# EAGLE design lora_esp32_gps (EAGLE 9.6.2)
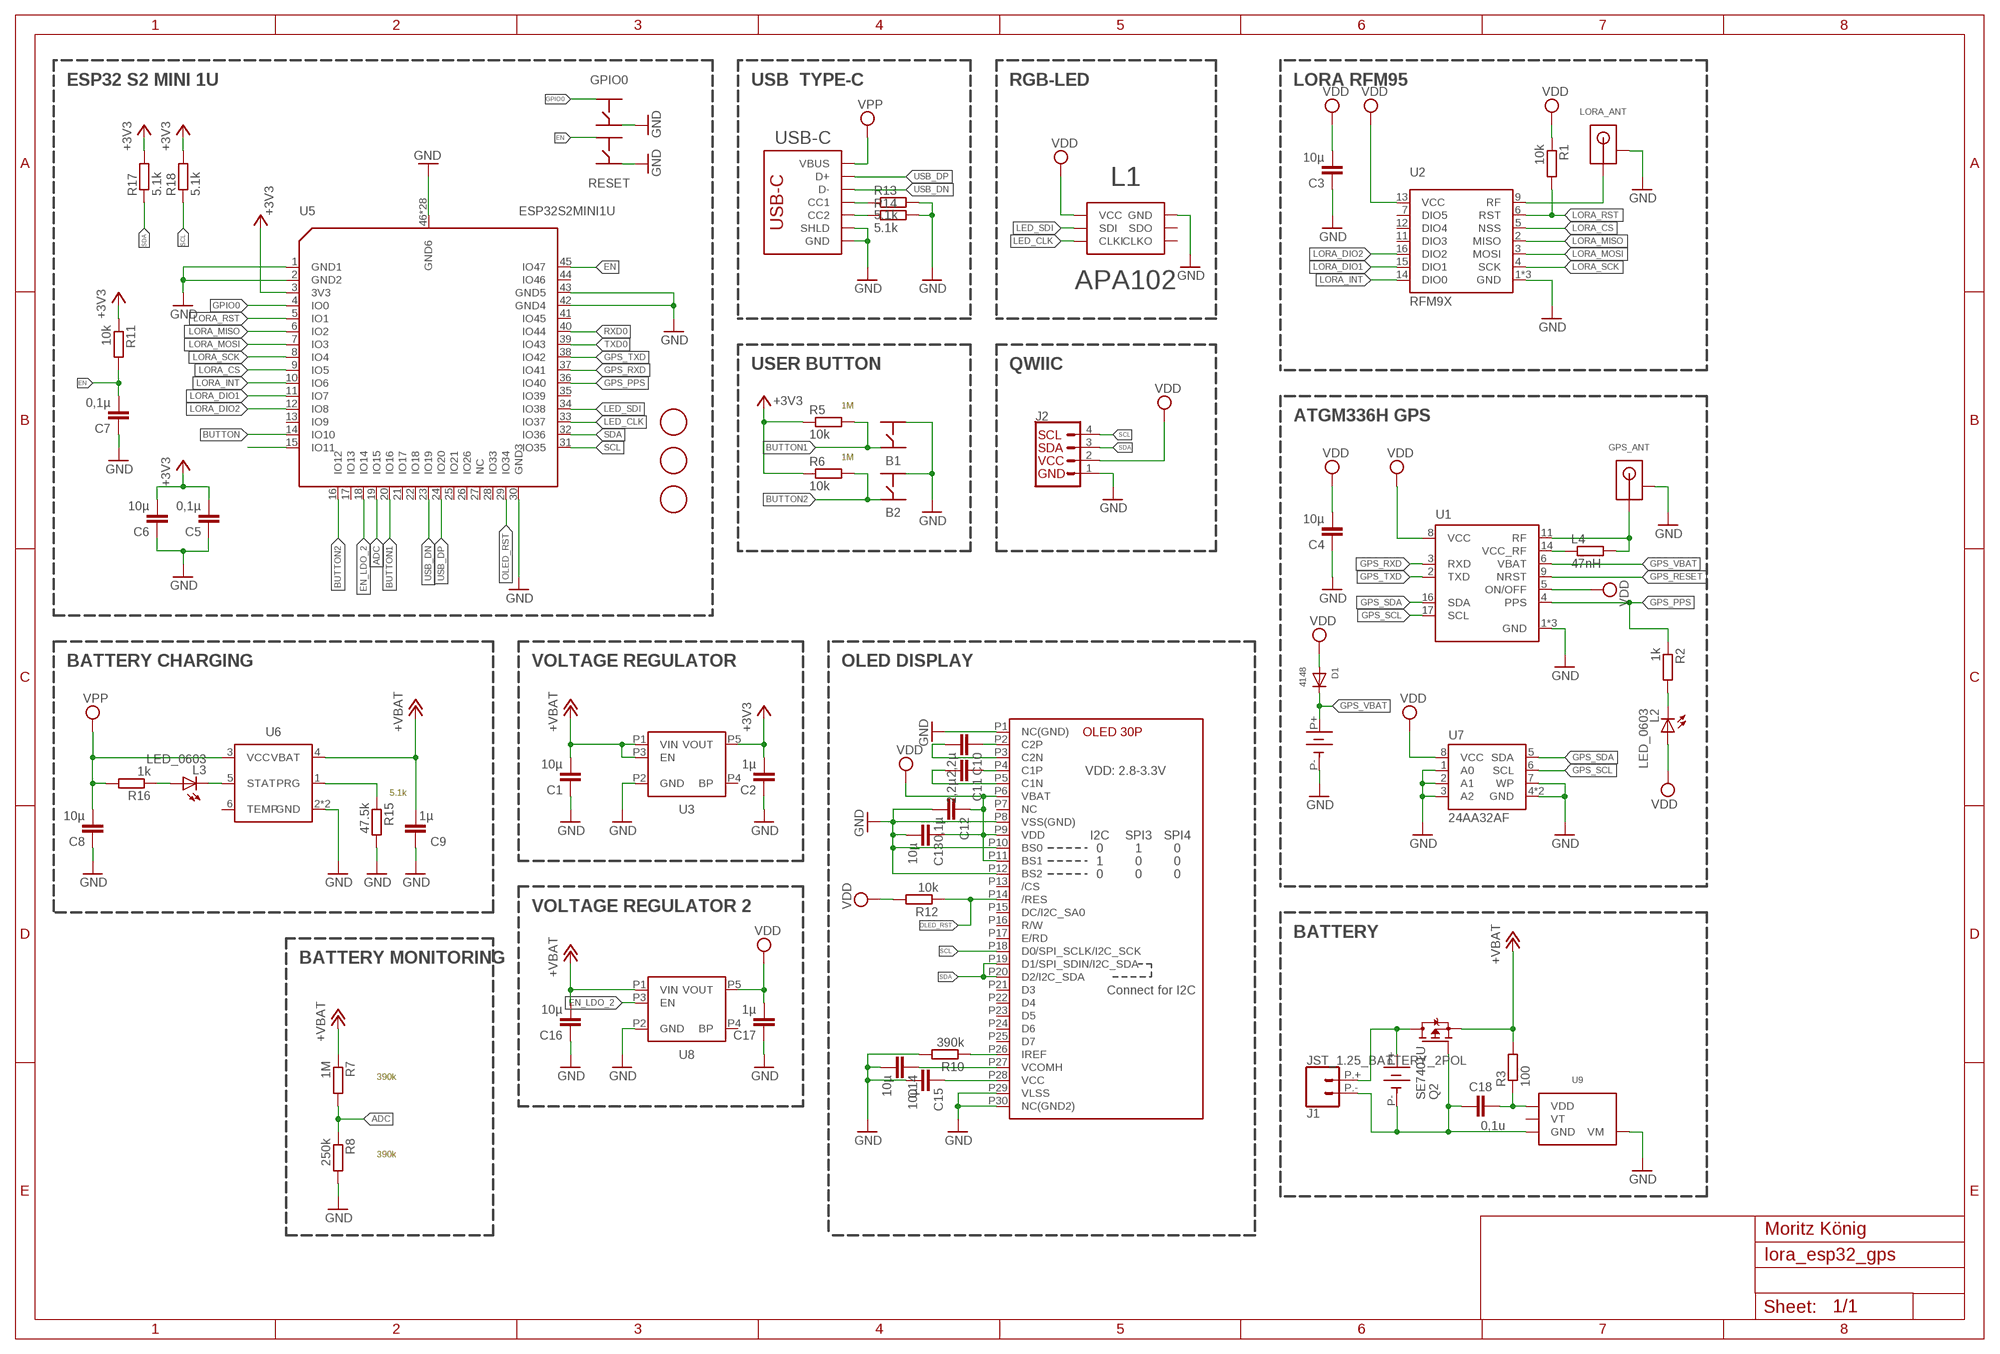
[diagram p0: schematic, sheet 1]

## Parts
B1  PTS840ESDGMSMTRLFS  [PTS840ESDGMSMTRLFS]
B2  PTS840ESDGMSMTRLFS  [PTS840ESDGMSMTRLFS]
BAT2  MS621  [MS621]
C1  10µ  C-EU_WO_KEEPOUT  [C0603]
C2  1µ  C-EU_WO_KEEPOUT  [C0603]
C3  10µ  C0603  [C0603]
C4  10µ  C0603  [C0603]
C5  0,1µ  C-EU_WO_KEEPOUT  [C0603]
C6  10µ  C-EU_WO_KEEPOUT  [C0603]
C7  0,1µ  C0603  [C0603]
C8  10µ  C0603  [C0603]
C9  1µ  C0603  [C0603]
C10  2,2µ  C-EU_WO_KEEPOUT  [C0603]
C11  2,2µ  C-EU_WO_KEEPOUT  [C0603]
C12  0,1µ  C-EU_WO_KEEPOUT  [C0603]
C13  10µ  C-EU_WO_KEEPOUT  [C0603]
C14  10µ  C-EU_WO_KEEPOUT  [C0603]
C15  10µ  C-EU_WO_KEEPOUT  [C0603]
C16  10µ  C-EU_WO_KEEPOUT  [C0603]
C17  1µ  C-EU_WO_KEEPOUT  [C0603]
C18  0,1u  C0603  [C0603]
D1  4148  DIODESOD-323F  [SOD-323F]
FID1  FIDUCIAL  [FIDUCIAL_1MM]
FID2  FIDUCIAL  [FIDUCIAL_1MM]
FID3  FIDUCIAL  [FIDUCIAL_1MM]
GPIO0  BUTTON_4PIN_TS_1177  [TS-1177-C-B-B]
GPS_ANT  UFL_ANT_CONNECTOR  [UFL_ANT_CONNECTOR]
J1  JST_1.25_BATTERY_2POL  [JST_1.25MM_2POL]
J2  QWIIC_CONNECTORJS-1MM  [1X04_1MM_RA]
L1  APA102_2020  [APA102_2020]
L2  LED_0603  [CHIPLED_0603]
L3  LED_0603  [CHIPLED_0603]
L4  47nH  R0402  [R0402]
LORA_ANT  UFL_ANT_CONNECTOR  [UFL_ANT_CONNECTOR]
Q2  SE7401U  [SOT323]
R1  10k  R0603  [R0603]
R2  1k  R0603  [R0603]
R3  100  R0603  [R0603]
R5  10k  R0603  [R0603]
R6  10k  R0603  [R0603]
R7  1M  R0603  [R0603]
R8  250k  R0603  [R0603]
R10  390k  R-EU_WO_KEEPOUT  [R0603]
R11  10k  R0603  [R0603]
R12  10k  R-EU_WO_KEEPOUT  [R0603]
R13  5.1k  R0603  [R0603]
R14  5.1k  R0603  [R0603]
R15  47.5k  R0603  [R0603]
R16  1k  R0603  [R0603]
R17  5.1k  R-EU_WO_KEEPOUT  [R0603]
R18  5.1k  R-EU_WO_KEEPOUT  [R0603]
RESET  BUTTON_4PIN_TS_1177  [TS-1177-C-B-B]
U1  ATGM336H  [ATGM336H-MODULE]
U2  RFM9X  [LORA_RFM9X]
U3  RT9193_SC70-5  [SC-70-5]
U4  OLD_096_SSD1306_30P_2B  [OLED_096_30P_B]
U5  ESP32S2MINI1U  ESP32-S2-MINI-1U  [ESP32-S2-MINI-1U]
U6  WS4518D  [DFN-6]
U7  24AA32AF  [TDFN8]
U8  RT9193_SC70-5  [SC-70-5]
U9  XB5353A  [SOT23-5]
U$2  BATTERY_KEYSTONE_1051  [KEYSTONE_1051]
USB-C  USB_C_C393939  [USBC_C393939]

## Nets
+3V3: C2.2 C5.2 C6.2 R5.1 R6.1 R11.1 R17.2 R18.2 U3.P5(VOUT) U5.3(3V3)
+VBAT: C1.2 C9.2 C16.2 Q2.2(S) R3.2 R7.1 U3.P1(VIN) U3.P3(EN) U6.4(VBAT) U8.P1(VIN)
ADC: R7.2 R8.1 U5.19(IO15)
BUTTON: U5.14(IO10)
BUTTON1: B1.2 R5.2 U5.20(IO16)
BUTTON2: B2.2 R6.2 U5.16(IO12)
EN: C7.2 R11.2 RESET.P4 U5.45(IO47)
EN_LDO_2: U5.18(IO14) U8.P3(EN)
GND: B1.3 B2.3 BAT2.P-(GND) C1.1 C2.1 C3.1 C4.1 C5.1 C6.1 C7.1 C8.1 C9.1 C12.2 C13.2 C14.2 C15.2 C16.1 C17.1 GPIO0.P1 GPS_ANT.P1.-(GND) GPS_ANT.P2.-(GND) J2.1(GND) L1.P6(GND) L1.P6.1(GND) LORA_ANT.P1.-(GND) LORA_ANT.P2.-(GND) R8.2 R10.2 R13.2 R14.2 R15.2 RESET.P1 U1.1(GND) U1.10(GND) U1.12(GND) U2.1(GND) U2.8(GND) U2.10(GND) U3.P2(GND) U4.P1(NC(GND)) U4.P8(VSS(GND)) U4.P10(BS0) U4.P12(BS2) U4.P29(VLSS) U4.P30(NC(GND2)) U5.1(GND1) U5.2(GND2) U5.30(GND3) U5.42(GND4) U5.43(GND5) U5.46(GND6) U5.47(GND6) U5.48(GND6) U5.49(GND6) U5.50(GND6) U5.51(GND6) U5.52(GND6) U5.53(GND6) U5.54(GND6) U5.55(GND6) U5.56(GND6) U5.57(GND6) U5.58(GND6) U5.59(GND6) U5.60(GND6) U5.61(GND6) U5.62(GND6) U5.63(GND6) U5.64(GND6) U5.65(GND6) U5.66(GND6) U5.67(GND6) U5.68(GND6) U5.69(GND6) U5.70(GND6) U5.71(GND6) U5.72(GND6) U5.73(GND6) U6.2(GND) U6.EXP(GND) U7.1(A0) U7.2(A1) U7.3(A2) U7.4(GND) U7.7(WP) U7.EXP(GND) U8.P2(GND) U9.4(VM) U9.5(VM) USB-C.A1B12(GND) USB-C.B1A12(GND) USB-C.S1(SHLD) USB-C.S2(SHLD) USB-C.S3(SHLD) USB-C.S4(SHLD)
GPIO0: GPIO0.P4 U5.4(IO0)
GPS_PPS: R2.1 U1.4(PPS) U5.36(IO40)
GPS_RESET: U1.9(NRST)
GPS_RXD: U1.3(RXD) U5.37(IO41)
GPS_SCL: U1.17(SCL) U7.6(SCL)
GPS_SDA: U1.16(SDA) U7.5(SDA)
GPS_TXD: U1.2(TXD) U5.38(IO42)
GPS_VBAT: BAT2.P+(VCC) D1.C U1.6(VBAT)
LED_CLK: L1.P5(CLKI) U5.33(IO37)
LED_SDI: L1.P4(SDI) U5.34(IO38)
LORA_CS: U2.5(NSS) U5.9(IO5)
LORA_DIO1: U2.15(DIO1) U5.11(IO7)
LORA_DIO2: U2.16(DIO2) U5.12(IO8)
LORA_INT: U2.14(DIO0) U5.10(IO6)
LORA_MISO: U2.2(MISO) U5.6(IO2)
LORA_MOSI: U2.3(MOSI) U5.7(IO3)
LORA_RST: R1.2 U2.6(RST) U5.5(IO1)
LORA_SCK: U2.4(SCK) U5.8(IO4)
N$1: L4.1 U1.14(VCC_RF)
N$2: L2.P$1(C) R2.2
N$3: U5.15(IO11)
N$4: GPS_ANT.ANT L4.2 U1.11(RF)
N$5: LORA_ANT.ANT U2.9(RF)
N$6: C18.2 R3.1 U9.3(VDD)
N$7: C18.1 J1.P.- Q2.1(G) U9.2(GND) U$2.P-(GND)
N$8: R15.1 U6.1(PRG)
N$9: J1.P.+ Q2.3(D) U$2.P+(VCC)
N$13: R14.1 USB-C.B5(CC2)
N$17: C10.1 U4.P2(C2P)
N$19: C10.2 U4.P3(C2N)
N$20: C11.2 U4.P5(C1N)
N$21: R10.1 U4.P26(IREF)
N$24: R13.1 USB-C.A5(CC1)
N$31: C11.1 U4.P4(C1P)
N$32: C15.1 U4.P28(VCC)
N$33: C14.1 U4.P27(VCOMH)
N$34: L3.P$2(A) R16.1
N$35: L3.P$1(C) U6.5(STAT)
OLED_RST: R12.1 U4.P14(/RES) U5.29(IO34)
RXD0: U5.40(IO44)
SCL: J2.4(SCL) R18.1 U4.P18(D0/SPI_SCLK/I2C_SCK) U5.31(IO35)
SDA: J2.3(SDA) R17.1 U4.P19(D1/SPI_SDIN/I2C_SDA) U4.P20(D2/I2C_SDA) U5.32(IO36)
TXD0: U5.39(IO43)
USB_DN: U5.23(IO19) USB-C.A7(D-) USB-C.B7(D-)
USB_DP: U5.24(IO20) USB-C.A6(D+) USB-C.B6(D+)
VDD: C3.2 C4.2 C12.1 C13.1 C17.2 D1.A J2.2(VCC) L1.P1(VCC) L1.P1.1(VCC) L2.P$2(A) R1.1 R12.2 U1.5(ON/OFF) U1.8(VCC) U2.13(VCC) U4.P6(VBAT) U4.P9(VDD) U4.P11(BS1) U7.8(VCC) U8.P5(VOUT)
VPP: C8.2 R16.2 U6.3(VCC) USB-C.A4B9(VBUS) USB-C.B4A9(VBUS)
Unconnected: B1.1 B1.4 B1.5 B2.1 B2.4 B2.5 GPIO0.P2 GPIO0.P3 L1.P2(CLKO) L1.P3(SDO) RESET.P2 RESET.P3 U2.7(DIO5) U2.11(DIO3) U2.12(DIO4) U3.P4(BP) U4.P7(NC) U4.P13(/CS) U4.P15(DC/I2C_SA0) U4.P16(R/W) U4.P17(E/RD) U4.P21(D3) U4.P22(D4) U4.P23(D5) U4.P24(D6) U4.P25(D7) U5.13(IO9) U5.17(IO13) U5.21(IO17) U5.22(IO18) U5.25(IO21) U5.26(IO26) U5.27(NC) U5.28(IO33) U5.35(IO39) U5.41(IO45) U5.44(IO46) U6.6(TEMP) U8.P4(BP) U9.1(VT)

## Notes on the sheet
- ESP32 S2 MINI 1U | USB  TYPE-C | RGB-LED | LORA RFM95
- USER BUTTON | QWIIC
- 1M
- ATGM336H GPS
- 1M
- BATTERY CHARGING | VOLTAGE REGULATOR | OLED DISPLAY
- 5.1k
- VOLTAGE REGULATOR 2
- BATTERY
- BATTERY MONITORING
- 390k
- 390k
- Moritz König

## Library data of the parts
B1 B2 = moekoe_switches:PTS840ESDGMSMTRLFS
BAT2 = moekoe_batteries:MS621
C1 C2 C5 C6 C10-C17 = moekoe:C-EU_WO_KEEPOUT
C3 C4 C7-C9 C18 = moekoe_rcl:C0603
D1 = adafruit:DIODE: Diode SMADIODE - SMA Surface Mount Package 20V 1A Schottky Diode Digikey: 641-1014-6-ND DO-1N4148 - Through Hole Small Current Diode SOD-123 20V 1 A (.5mV Vf) Schottky Diode - Digikey: MBRX120TPMSCT-ND SOD-323 10V 570mA (.38mV Vf, 3ns) Schottky Diode - Digikey: ZLLS410CT-ND SOD-523 30V 30mA Schottky Diode (RB751S-40TE61) - Digikey: RB751S-40TE61CT-ND SOT23-R/W - SOT23 Package (R = Solder Paste/Reflow Ovens, W = Hand-Soldering) BAT54Film 40V 300mA - Digikey: 497-7162-1-ND
FID1-FID3 = adafruit:FIDUCIAL: For use by pick and place machines to calibrate the vision/machine, 1mm By microbuilder.eu
GPIO0 RESET = moekoe:BUTTON_4PIN
GPS_ANT LORA_ANT = moekoe_hardware:UFL_ANT_CONNECTOR
J1 = moekoe_hardware:JST_1.25_BATTERY_2POL
J2 = SparkFun-Connectors:QWIIC_CONNECTOR: SparkFun I2C Standard Qwiic Connector An SMD 1mm pitch JST connector makes it easy and quick (get it? Qwiic?) to connect I2C devices to each other. The Qwiic system <http://www.sparkfun.com/qwiic> enables fast and solderless connection between popular platforms and various sensors and actuators. We carry 200mm <https://www.sparkfun.com/products/14204>, 100mm <https://www.sparkfun.com/products/14205>, 50mm <https://www.sparkfun.com/products/14206>, and breadboard friendly <https://www.sparkfun.com/products/14207> Qwiic cables. We also offer 10 pcs strips <https://www.sparkfun.com/products/14323> the SMD connectors.
L1 = moekoe_led:APA102_2020
L2 L3 = moekoe_led:LED_0603
L4 = moekoe_rcl:R0402
Q2 = moekoe_discrete:SE7401U
R1-R3 R5-R8 R11 R13-R16 = moekoe_rcl:R0603
R10 R12 R17 R18 = moekoe:R-EU_WO_KEEPOUT
U1 = moekoe_ics:ATGM336H
U2 = moekoe_ics:RFM9X
U3 U8 = moekoe:RT9193_SC70-5
U4 = moekoe:OLD_096_SSD1306_30P
U5 = moekoe_controllers:ESP32-S2-MINI-1U
U6 = moekoe_ics:WS4518D
U7 = moekoe_ics:24AA32AF
U9 = moekoe_ics:XB5353A
U$2 = moekoe_batteries:BATTERY_KEYSTONE_1051
USB-C = moekoe_hardware:USB_C_C393939

## Board
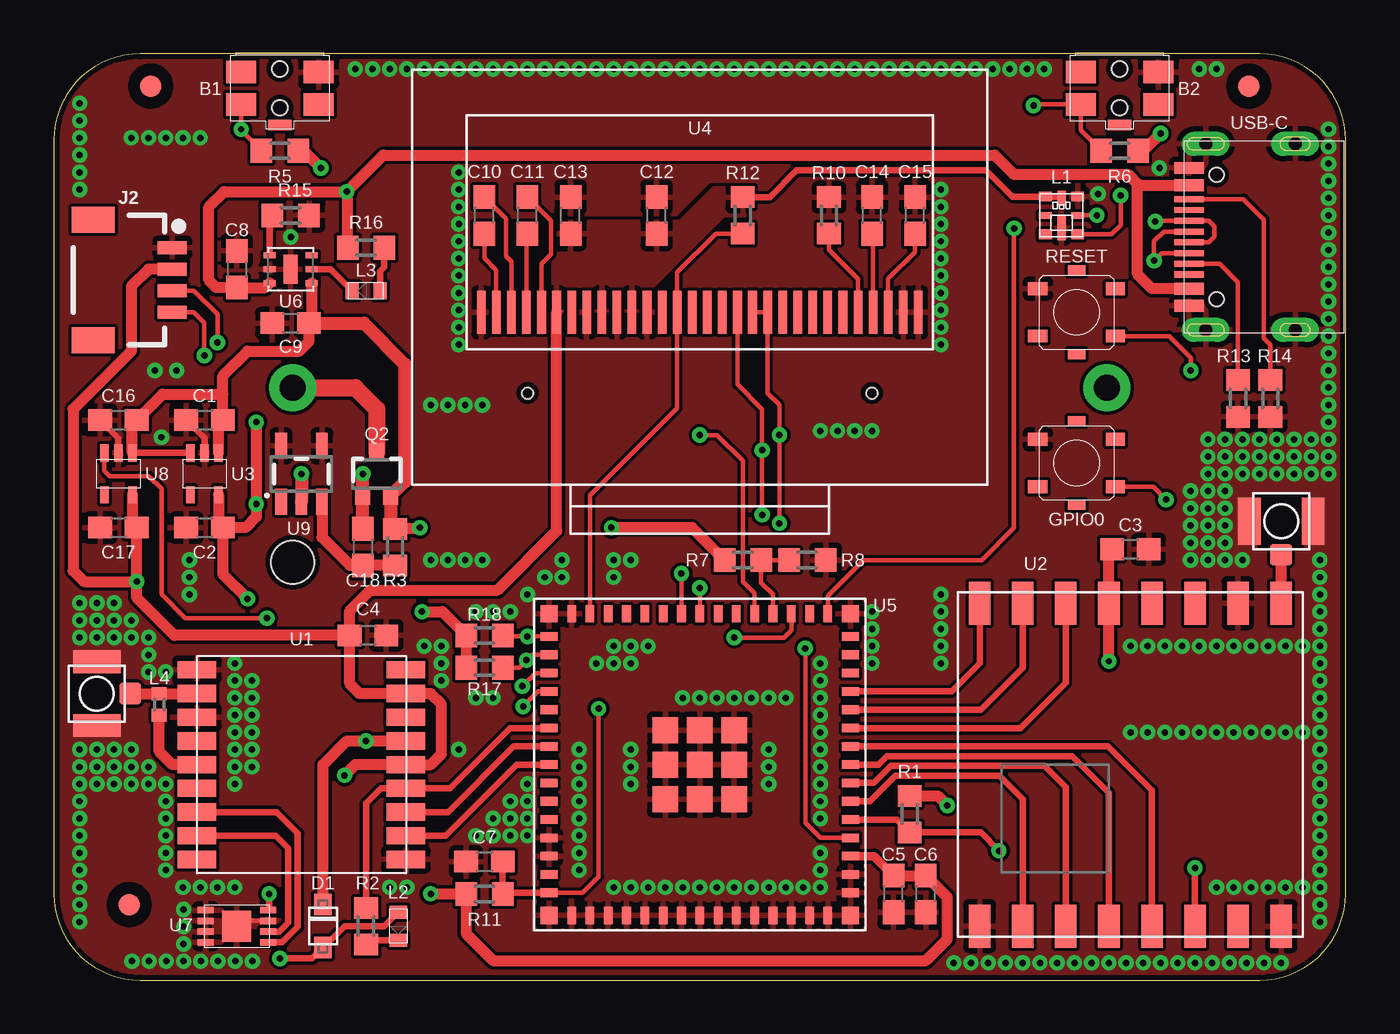
[diagram p1: board, top side]
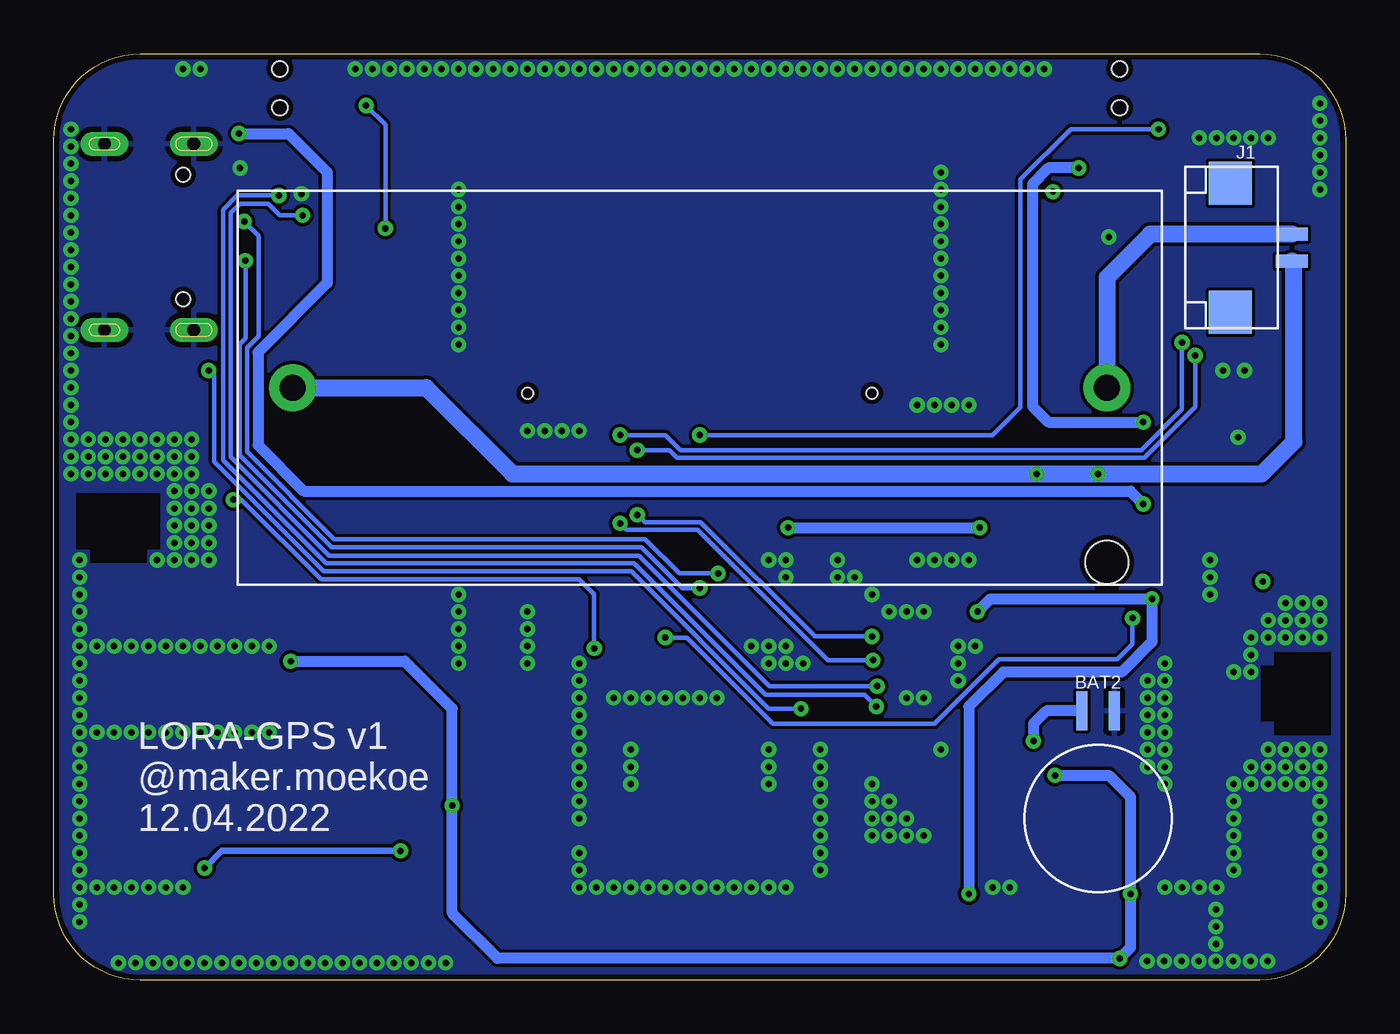
[diagram p2: board, bottom side, seen from below]

Size 60 x 43 mm. Coordinates in mm from the lower left corner, seen from the top.
Outline: 56,43 4,43 arc90 0,39 0,4 arc90 4,0 56,0 arc90 60,4 60,39 arc90 56,43
Copper layers (1*16): Top 0.035mm / dielectric 1.5mm / Bottom 0.035mm
Design rules "default *": minimum track width 6mil, minimum drill 0.3mm, track to track 6mil, track to pad 6mil, pad to pad 6mil, via to via 6mil, smd to smd 6mil, copper to edge 10mil, drill to drill 6mil, minimum pad ring 10mil, minimum via ring 8mil, stop-mask expansion 0mil, vias tented up to drill 0.5mm, thermal gap 10mil

### Footprints (pad centres in the part's own frame; a part is rotated, then mirrored left to right if it is on the bottom)
PTS840ESDGMSMTRLFS = smd 1.4 x 1.05: 1 -1.8,0.75; 2 1.8,0.75; 3 -1.8,-0.75; 4 1.8,-0.75 | smd 1.1 x 0.5: 5 0,1.7 | hole 0.7: 0,0.9; 0,-0.9
MS621 = smd 1.8 x 0.5: P+ 0,0.75; P- 0,-0.75
C0603 = smd 1.1 x 1: 1 -0.85,0; 2 0.85,0
SOD-323F = smd 1 x 0.8: A -1,0; C 1,0
FIDUCIAL_1MM = smd 1 x 1: 1 0,0
TS-1177-C-B-B = smd 0.9 x 0.6: P1 -1.8,1.1; P2 1.8,1.1; P3 -1.8,-1.1; P4 1.8,-1.1 | smd 0.8 x 0.45: P$5 0,1.95; P$6 0,-1.95
UFL_ANT_CONNECTOR = smd 1 x 1: ANT 0,1.55 | smd 1.05 x 2.2: P1.- -1.475,0; P2.- 1.475,0
JST_1.25MM_2POL = smd 2 x 2: P$3 3,2.85; P$4 -3,2.85 | smd 0.6 x 1.5: P.+ 0.625,0; P.- -0.625,0
1X04_1MM_RA = smd 0.6 x 1.35: 1 -1.5,0; 2 -0.5,0; 3 0.5,0; 4 1.5,0 | smd 1.2 x 2: NC1 2.8,-3.675; NC2 -2.8,-3.675
APA102_2020 = smd 0.6 x 0.45: P1 -0.75,0.875; P3 -0.75,-0.875; P4 0.75,-0.875; P6 0.75,0.875 | smd 0.4 x 0.7: P1.1 0,0.8 | smd 0.6 x 0.3: P2 -0.75,0; P5 0.75,0 | smd 0.4 x 1.1: P6.1 0,-0.6
CHIPLED_0603 = smd 0.6 x 0.8: P$1 -0.65,0; P$2 0.65,0
R0402 = smd 0.6 x 0.7: 1 -0.5,0; 2 0.5,0
SOT323 = smd 0.7 x 0.8: 1 -0.65,-1.025; 2 0.65,-1.025; 3 0,1.025
R0603 = smd 1 x 1.1: 1 -0.85,0; 2 0.85,0
ATGM336H-MODULE = smd 1.8 x 0.8: 1 4.85,-4.4; 2 4.85,-3.3; 3 4.85,-2.2; 4 4.85,-1.1; 5 4.85,0; 6 4.85,1.1; 7 4.85,2.2; 8 4.85,3.3; 9 4.85,4.4; 10 -4.85,4.4; 11 -4.85,3.3; 12 -4.85,2.2; 13 -4.85,1.1; 14 -4.85,0; 15 -4.85,-1.1; 16 -4.85,-2.2; 17 -4.85,-3.3; 18 -4.85,-4.4
LORA_RFM9X = smd 2 x 1: 1 -7.5,7; 2 -7.5,5; 3 -7.5,3; 4 -7.5,1; 5 -7.5,-1; 6 -7.5,-3; 7 -7.5,-5; 8 -7.5,-7; 9 7.5,-7; 10 7.5,-5; 11 7.5,-3; 12 7.5,-1; 13 7.5,1; 14 7.5,3; 15 7.5,5; 16 7.5,7
SC-70-5 = smd 0.4 x 0.8: P1 0.65,0.97; P2 0,0.97; P3 -0.65,0.97; P4 -0.65,-0.97; P5 0.65,-0.97
OLED_096_30P_B = smd 0.4 x 2: P1 -10.15,20; P2 -9.45,20; P3 -8.75,20; P4 -8.05,20; P5 -7.35,20; P6 -6.65,20; P7 -5.95,20; P8 -5.25,20; P9 -4.55,20; P10 -3.85,20; P11 -3.15,20; P12 -2.45,20; P13 -1.75,20; P14 -1.05,20; P15 -0.35,20; P16 0.35,20; P17 1.05,20; P18 1.75,20; P19 2.45,20; P20 3.15,20; P21 3.85,20; P22 4.55,20; P23 5.25,20; P24 5.95,20; P25 6.65,20; P26 7.35,20; P27 8.05,20; P28 8.75,20; P29 9.45,20; P30 10.15,20 | hole 0.5: -8,16.25; 8,16.25
ESP32-S2-MINI-1U = smd 0.8 x 0.4: 1 -7,5.95; 2 -7,5.1; 3 -7,4.25; 4 -7,3.4; 5 -7,2.55; 6 -7,1.7; 7 -7,0.85; 8 -7,0; 9 -7,-0.85; 10 -7,-1.7; 11 -7,-2.55; 12 -7,-3.4; 13 -7,-4.25; 14 -7,-5.1; 15 -7,-5.95; 31 7,-5.95; 32 7,-5.1; 33 7,-4.25; 34 7,-3.4; 35 7,-2.55; 36 7,-1.7; 37 7,-0.85; 38 7,0; 39 7,0.85; 40 7,1.7; 41 7,2.55; 42 7,3.4; 43 7,4.25; 44 7,5.1; 45 7,5.95 | smd 0.4 x 0.8: 16 -5.95,-7; 17 -5.1,-7; 18 -4.25,-7; 19 -3.4,-7; 20 -2.55,-7; 21 -1.7,-7; 22 -0.85,-7; 23 0,-7; 24 0.85,-7; 25 1.7,-7; 26 2.55,-7; 27 3.4,-7; 28 4.25,-7; 29 5.1,-7; 30 5.95,-7; 46 5.95,7; 47 5.1,7; 48 4.25,7; 49 3.4,7; 50 2.55,7; 51 1.7,7; 52 0.85,7; 53 0,7; 54 -0.85,7; 55 -1.7,7; 56 -2.55,7; 57 -3.4,7; 58 -4.25,7; 59 -5.1,7; 60 -5.95,7 | smd 1.2 x 1.2: 61 0,0; 66 -1.6,1.6; 67 -1.6,0; 68 -1.6,-1.6; 69 0,-1.6; 70 1.6,-1.6; 71 1.6,0; 72 1.6,1.6; 73 0,1.6 | smd 0.8 x 0.8: 62 -7,7; 63 -7,-7; 64 7,-7; 65 7,7
DFN-6 = smd 0.55 x 0.3: 1 -0.975,0.65; 2 -0.975,0; 3 -0.975,-0.65; 4 0.975,-0.65; 5 0.975,0; 6 0.975,0.65 | smd 0.65 x 1.35: EXP 0,0
TDFN8 = smd 0.3 x 0.75: 1 -0.75,-1.45; 2 -0.25,-1.45; 3 0.25,-1.45; 4 0.75,-1.45; 5 0.75,1.45; 6 0.25,1.45; 7 -0.25,1.45; 8 -0.75,1.45 | smd 1.45 x 1.35: EXP 0,0
SOT23-5 = smd 0.55 x 1.2: 1 -0.95,-1.3; 2 0,-1.3; 3 0.95,-1.3; 4 0.95,1.3; 5 -0.95,1.3
KEYSTONE_1051 = drill 1.2 pad 2.2: P+ -18.91,0; P- 18.91,0 | hole 2: -18.91,8.1
USBC_C393939 = smd 0.55 x 1.35: A1B12 -3.2,0.775; A4B9 -2.4,0.775; B1A12 3.2,0.775; B4A9 2.4,0.775 | smd 0.275 x 1.35: A5 -1.25,0.775; A6 -0.25,0.775; A7 0.25,0.775; B5 1.75,0.775; B6 0.75,0.775; B7 -0.75,0.775; B8 1.25,0.775 | smd 0.3 x 1.35: A8 -1.75,0.775 | drill 0.6 pad 1 long: S1 -4.32,0; S2 4.32,0; S3 -4.32,-4.15; S4 4.32,-4.15 | hole 0.65: 2.89,-0.5; -2.89,-0.5

### Placement (x,y rotation side)
B1  10.5,41.4 180 top
B2  49.5,41.4 180 top
BAT2  11.5,12.5 90 bottom
C1  7,26 0 top
C2  7,21 0 top
C3  50,20 180 top
C4  14.59,16 180 top
C5  39,4 90 top
C6  40.5,4 90 top
C7  20,5.5 0 top
C8  8.5,33 270 top
C9  11,30.5 0 top
C10  20,35.5 90 top
C11  22,35.5 90 top
C12  28,35.5 90 top
C13  24,35.5 90 top
C14  38,35.5 90 top
C15  40,35.5 90 top
C16  3,26 0 top
C17  3,21 0 top
C18  14.35,20.1 270 top
D1  12.5,2.5 90 top
FID1  55.5,41.5 0 top
FID2  3.5,3.5 0 top
FID3  4.5,41.5 0 top
GPIO0  47.5,24 0 top
GPS_ANT  2,13.3 270 top
J1  2.5,34 90 bottom
J2  5.5,32.5 270 top
L1  46.8,35.5 0 top
L2  16,2.5 90 top
L3  14.5,32 0 top
L4  4.9,12.8 90 top
LORA_ANT  57,21.3 180 top
Q2  15,23.5 0 top
R1  39.75,7.7 270 top
R2  14.5,2.5 270 top
R3  15.85,20.1 90 top
R5  10.5,38.5 180 top
R6  49.5,38.5 180 top
R7  32,19.5 0 top
R8  35,19.5 0 top
R10  36,35.5 90 top
R11  20,4 0 top
R12  32,35.5 90 top
R13  55,27 270 top
R14  56.5,27 270 top
R15  11,35.5 0 top
R16  14.5,34 180 top
R17  20,14.5 180 top
R18  20,16 180 top
RESET  47.5,31 0 top
U1  11.5,10 0 top
U2  50,10 90 top
U3  7,23.5 0 top
U4  30,11 0 top
U5  30,10 180 top
U6  11,33 0 top
U7  8.5,2.5 270 top
U8  3,23.5 0 top
U9  11.5,23.5 0 top
U$2  30,27.5 180 bottom
USB-C  53.5,34.5 90 top

### Tracks (layer width: path | path; a pad name or v marks a point on that pad's centre or on a via)
+3V3  (via drill 0.3 pad 0.6)
  Top 0.4: U5.3 38.1,5.75 C5.2
  Top 0.5: U3.P5 7.65,21.2 C2.2 | C5.2 C6.2 41.5,3.85 41.5,1.9 40.5,0.9 20.4,0.9 19.15,2.15 R11.1 v17.5,4 | R5.1 11.6,38.5 v12.4,37.7 | v9.4,25.9 v9.4,22.1 9.4,21.5 8.9,21 C2.2 | C2.2 7.85,18.85 v9,17.7 | v17.1,17.1 18.05,17.1 R18.2 R17.2 | R6.1 50.6,38.5 v51.4,39.3
  Bottom 0.5: v12.4,37.7 13.8,37.7 14.55,36.95 14.55,26.65 13.8,25.9 v9.4,25.9 | v17.1,17.1 16.5,17.7 v9,17.7 9,15.7 10.4,14.3 15.9,14.3 17.5,12.7 v17.5,4 | v51.4,39.3 49.1,39.3 47.3,37.5 47.3,32.36 50.52,29.14 50.52,24.83 48.39,22.7 10,22.7 v9.4,22.1
+VBAT  (via drill 0.3 pad 0.6)
  Top 0.3: U3.P3 U8.P1
  Top 0.5: U3.P1 7.65,25.8 C1.2 7.85,27.2 | U8.P1 3.65,25.8 C16.2 5.05,27.2 7.85,27.2 | U6.4 11.97,30.62 C9.2 11.85,29.65 11.4,29.2 9,29.2 7.85,28.05 7.85,27.2 | R7.1 29.65,21 v25.9,21 | v17,21 16.95,20.95 R3.2
  Top 0.6: R3.2 15.65,21.15 Q2.2 16.3,23.12 16.3,28.6 14.4,30.5 C9.2
  Bottom 0.5: v25.9,21 v17,21
ADC
  Top 0.2: U5.19 33.4,17.9 32.85,18.45 R7.2 R8.1
BUTTON1  (via drill 0.3 pad 0.6)
  Top 0.2: U5.20 32.55,17.95 32,18.5 32,24.1 30.8,25.3 v30,25.3 | R5.2 8.7,39.45 v8.7,39.5 B1.2
  Bottom 0.2: v30,25.3 16.4,25.3 15.1,26.6 15.1,37.17 12.78,39.5 v8.7,39.5
BUTTON2  (via drill 0.3 pad 0.6)
  Top 0.2: U5.16 35.95,17.85 37.6,19.5 43.1,19.5 44.6,21 v44.6,34.9 | R6.2 47.7,39.45 B2.2 45.55,40.65 v45.5,40.6
  Bottom 0.2: v44.6,34.9 44.6,39.7 v45.5,40.6
EN  (via drill 0.3 pad 0.6)
  Top 0.2: U5.45 24.55,4.05 25.3,4.8 v25.3,12.6 | RESET.P4 51.8,29.9 52.81,28.89 v52.81,28.3
  Top 0.3: U5.45 20.9,4.05 R11.2 C7.2
  Bottom 0.2: v25.3,12.6 26.8,12.6 33.17,18.97 47.47,18.97 52.55,24.05 52.55,28.05 v52.81,28.3
EN_LDO_2  (via drill 0.3 pad 0.6)
  Top 0.2: U8.P3 2.35,23.65 2.6,23.4 4.4,23.4 5,22.8 5,17.9 6.1,16.8 v9.9,16.8 | v31.6,15.9 33.9,15.9 34.25,16.25 U5.18
  Bottom 0.2: v9.9,16.8 9.9,15.6 10.6,14.9 16.1,14.9 19.1,11.9 26.6,11.9 30.6,15.9 v31.6,15.9
GND  (via drill 0.3 pad 0.6)
  Top 0.2: U7.7 8.75,2.75 U7.EXP
  Top 0.3: U3.P2 7,25.15 C1.1 | U8.P2 3,25.15 C16.1
  other vias: 5,25.2 48.5,36.5 11,34.5 5.7,28.3 4.7,28.3 30,42.3 29.2,42.3 28.4,42.3 27.6,42.3 26.8,42.3 26,42.3 25.2,42.3 24.4,42.3 23.6,42.3 22.8,42.3 22,42.3 21.2,42.3 20.4,42.3 19.6,42.3 18.8,42.3 18,42.3 17.2,42.3 16.4,42.3 15.6,42.3 14.8,42.3 14,42.3 30.8,42.3 31.6,42.3 32.4,42.3 33.2,42.3 34,42.3 34.8,42.3 35.6,42.3 36.4,42.3 37.2,42.3 38,42.3 38.8,42.3 39.6,42.3 40.4,42.3 41.2,42.3 42,42.3 42.8,42.3 43.6,42.3 44.4,42.3 45.2,42.3 46,42.3 53.2,42.3 54,42.3 1.2,15.9 2,15.9 3.6,15.9 2.8,15.9 1.2,10.7 2,10.7 2.8,10.7 3.6,10.7 4.4,15.9 4.4,15.1 4.4,14.3 5.2,14.3 1.2,9.9 2,9.9 2.8,9.9 3.6,9.9 2,16.7 1.2,16.7 2.8,16.7 3.6,16.7 1.2,9.1 1.2,8.3 1.2,7.5 1.2,6.7 1.2,5.9 1.2,5.1 1.2,4.3 1.2,3.5 1.2,2.7 1.2,36.7 1.2,37.5 1.2,38.3 1.2,39.1 1.2,39.9 1.2,40.7 58.8,2.7 58.8,3.5 58.8,4.3 58.8,5.1 58.8,5.9 58.8,6.7 58.8,7.5 58.8,8.3 58.8,9.1 58.8,9.9 58.8,10.7 58.8,11.5 58.8,12.3 58.8,13.1 58.8,13.9 58.8,14.7 58.8,15.5 58.8,16.3 58.8,17.1 58.8,17.9 58.8,18.7 58.8,19.5 55.2,19.5 54.4,19.5 54.4,20.3 54.4,21.1 54.4,21.9 54.4,22.7 54.4,23.5 55.2,23.5 56,23.5 56.8,23.5 57.6,23.5 58.4,23.5 59.2,23.5 52.8,21.1 52.8,19.5 52.8,22.7 55.2,25.1 56.8,25.1 58.4,25.1 51.35,37.7 42.6,0.8 41.8,0.8 43.4,0.8 44.2,0.8 45,0.8 45.8,0.8 46.6,0.8 47.4,0.8 48.2,0.8 49,0.8 49.8,0.8 50.6,0.8 51.4,0.8 52.2,0.8 53,0.8 53.8,0.8 54.6,0.8 55.4,0.8 56.2,0.8 57,0.8 54,4.3 54.8,4.3 55.6,4.3 56.4,4.3 57.2,4.3 58,4.3 58,15.5 57.2,15.5 56.4,15.5 55.6,15.5 54.8,15.5 54,15.5 53.2,15.5 52.4,15.5 51.6,15.5 50.8,15.5 50,15.5 5.2,9.1 5.2,8.3 5.2,7.5 5.2,6.7 5.2,5.9 5.2,5.1 6,4.3 6.8,4.3 7.6,4.3 8.4,4.3 8.4,14.7 8.4,13.9 8.4,13.1 8.4,12.3 8.4,11.5 8.4,10.7 8.4,9.9 8.4,9.1 15.6,4.3 16.4,4.3 18.8,10.7 19.6,6.7 20.4,6.7 21.2,6.7 22,6.7 22,7.5 22,8.3 22,9.1 20.4,7.5 21.2,8.3 21.2,7.5 19.6,13.1 20.4,13.1 26,4.3 26.8,4.3 27.6,4.3 28.4,4.3 29.2,4.3 30,4.3 30.8,4.3 31.6,4.3 32.4,4.3 33.2,4.3 34,4.3 34.8,4.3 35.6,4.3 35.6,5.1 35.6,5.9 35.6,7.5 35.6,8.3 35.6,9.1 35.6,9.9 35.6,10.7 35.6,11.5 35.6,12.3 35.6,13.1 35.6,13.9 35.6,14.7 38,17.1 38,16.3 38,15.5 38,14.7 41.2,17.9 41.2,17.1 41.2,16.3 41.2,15.5 41.2,14.7 17.2,15.5 18,15.5 18,14.7 18,13.9 18.8,37.5 18.8,36.7 18.8,35.9 18.8,35.1 18.8,34.3 18.8,33.5 18.8,32.7 18.8,31.9 18.8,31.1 18.8,30.3 41.2,36.7 41.2,35.9 41.2,35.1 41.2,34.3 41.2,33.5 41.2,32.7 41.2,31.9 41.2,31.1 41.2,30.3 41.2,29.5 18.8,29.5 26,15.5 26.8,15.5 27.6,15.5 25.2,14.7 26,14.7 26.8,14.7 26,18.7 26.8,19.5 26,19.5 22.8,18.7 23.6,18.7 23.6,19.5 22,17.9 21.2,17.1 20.4,17.1 19.6,17.1 29.2,13.1 30,13.1 30.8,13.1 31.6,13.1 33.2,13.1 32.4,13.1 34,13.1 33.2,10.7 33.2,9.9 33.2,9.1 26.8,10.7 26.8,9.9 26.8,9.1 24.4,9.9 24.4,9.1 24.4,8.3 24.4,7.5 24.4,6.7 24.4,5.9 24.4,5.1 24.4,10.7 52.4,11.5 53.2,11.5 54,11.5 54.8,11.5 55.6,11.5 56.4,11.5 58,11.5 57.2,11.5 51.6,11.5 50.8,11.5 50,11.5 8.43,0.88 7.62,0.88 9.22,0.88 6.83,0.88 6.03,0.88 5.22,0.88 4.42,0.88 3.62,0.88 6.03,3.27 6.03,2.48 6.03,1.68 6.3,19.5 6.3,18.7 6.3,17.9 17.5,19.5 18.3,19.5 19.1,19.5 17.5,26.7 18.3,26.7 19.1,26.7 19.9,26.7 19.9,19.5 3.6,39.1 4.4,39.1 5.2,39.1 6,39.1 6.8,39.1 35.6,25.5 36.4,25.5 37.2,25.5 38,25.5 59.2,24.3 59.2,25.9 59.2,25.1 59.2,26.7 59.2,27.5 59.2,28.3 59.2,29.9 59.2,29.1 59.2,30.7 59.2,31.5 59.2,32.3 59.2,33.1 59.2,33.9 59.2,34.7 59.2,36.3 59.2,35.5 59.2,37.1 59.2,37.9 59.2,38.7 59.2,39.5 52.8,21.9 52.8,20.3 56,25.1 57.6,25.1 54.4,25.1 53.6,25.1 53.6,22.7 53.6,23.5 53.6,24.3 54.4,24.3 55.2,24.3 56,24.3 56.8,24.3 57.6,24.3 58.4,24.3 53.6,21.9 53.6,21.1 53.6,20.3 53.6,19.5 2,9.1 2.8,9.1 3.6,9.1 4.4,9.1 4.4,9.9 1.2,17.5 2,17.5 2.8,17.5 9.2,13.9 9.2,13.1 9.2,12.3 9.2,11.5 9.2,10.7 9.2,9.9
  pour Top (rank 3): -0.4,43.9 60.9,43.9 60.9,-0.9 -0.4,-0.9
  pour Bottom (rank 3): -0.4,43.9 60.9,43.9 60.9,-0.9 -0.4,-0.9
  pour Top (no thermals): 0,12 4,12 4,10.4 0,10.4
  pour Top (no thermals): 0,16.2 4,16.2 4,14.6 0,14.6
  pour Top (no thermals): 54.2,19.2 54.2,23.2 55.8,23.2 55.8,19.2
  pour Top (no thermals): 58.2,19.2 58.2,23.2 59.8,23.2 59.8,19.2
GPIO0  (via drill 0.3 pad 0.6)
  Top 0.2: U5.4 35.6,6.6 34.9,7.3 v34.9,15.4 | v51.66,22.3 51.06,22.9 GPIO0.P4
  Bottom 0.2: v34.9,15.4 34.9,17.9 35.59,18.59 47.59,18.59 51.3,22.3 v51.66,22.3
GPS_PPS
  Top 0.3: U5.36 21.2,11.7 18.4,8.9 U1.4 15.2,8.9 14.5,8.2 R2.1
GPS_RXD
  Top 0.3: U1.3 18.3,7.8 21.35,10.85 U5.37
GPS_SCL
  Top 0.3: U7.6 10.47,2.25 10.88,2.65 10.88,6.12 10.3,6.7 U1.17
GPS_SDA
  Top 0.3: U7.5 10.62,1.75 11.33,2.46 11.33,6.81 10.34,7.8 U1.16
GPS_TXD
  Top 0.3: U1.2 18.2,6.7 21.5,10 U5.38
GPS_VBAT  (via drill 0.3 pad 0.6)
  Top 0.5: D1.C 12.5,10 13.6,11.1 v14.5,11.1 U1.6
  Bottom 0.5: BAT2.P+ 13.9,12.5 14.5,11.9 v14.5,11.1
LED_CLK  (via drill 0.3 pad 0.6)
  Top 0.2: U5.33 22.36,14.25 v21.76,13.64 | v48.44,35.5 L1.P5
  Bottom 0.2: v21.76,13.64 26.76,13.64 32.82,19.7 47.2,19.7 51.79,24.29 51.79,35.61 51.35,36.05 50.05,36.05 49.51,35.5 v48.44,35.5
LED_SDI  (via drill 0.3 pad 0.6)
  Top 0.2: U5.34 22.5,13.4 v21.8,12.7 | v49.55,36.42 49.55,35.05 49.12,34.62 L1.P4
  Bottom 0.2: v21.8,12.7 22.35,13.25 26.95,13.25 33.05,19.35 47.35,19.35 52.14,24.14 52.14,35.76 51.48,36.42 v49.55,36.42
LORA_CS
  Top 0.3: U5.9 48.95,10.85 51,8.8 U2.5
LORA_DIO1
  Top 0.3: U5.11 43.05,12.55 45,14.5 U2.15
LORA_DIO2
  Top 0.3: U5.12 41.7,13.4 43,14.7 U2.16
LORA_INT
  Top 0.3: U5.10 44.9,11.7 47,13.8 U2.14
LORA_MISO
  Top 0.3: U5.6 37.9,8.3 39.09,9.49 43.91,9.49 45,8.4 U2.2
LORA_MOSI
  Top 0.3: U5.7 38.09,9.15 38.88,9.95 46,9.95 47,8.95 U2.3
LORA_RST  (via drill 0.3 pad 0.6)
  Top 0.3: U5.5 39.15,7.45 R1.2 43.05,6.85 v43.9,6 | v53,5.2 U2.6
  Bottom 0.3: v43.9,6 52.2,6 v53,5.2
LORA_SCK
  Top 0.3: U5.8 38.3,10 38.7,10.4 47.3,10.4 49,8.7 U2.4
N$1
  Top 0.5: U1.14 5.5,10 4.9,10.6 L4.1
N$2
  Top 0.3: R2.2 14.7,1.85 L2.P$1
N$4
  Top 0.5: GPS_ANT.ANT L4.2 U1.11
N$5
  Top 0.5: U2.9 LORA_ANT.ANT
N$6
  Top 0.5: U9.3 12.45,20.55 13.75,19.25 C18.2 R3.1
N$7  (via drill 0.3 pad 0.6)
  Top 0.6: v11.5,23.5 U9.2 | v14.35,23.5 Q2.1 C18.1
  Bottom 0.8: U$2.P- 42.7,27.5 38.7,23.5 v14.35,23.5 v11.5,23.5 3.9,23.5 2.4,25 2.4,33.27 J1.P.-
N$8
  Top 0.3: U6.1 10.03,35.38 R15.1
N$9
  Top 0.8: U$2.P+ 14,27.5 15,26.5 Q2.3
  Bottom 0.8: J1.P.+ 9.07,34.62 11.09,32.61 U$2.P+
N$13
  Top 0.2: USB-C.B5 55.25,36.25 56.2,35.3 56.2,29.8 56.5,29.5 R14.1
N$17
  Top 0.2: C10.1 20,33.5 20.55,32.95 U4.P2
N$19
  Top 0.2: C10.2 21,35.35 21,33.6 21.25,33.35 U4.P3
N$20
  Top 0.2: C11.2 23.1,35.25 23.1,33.7 22.65,33.25 U4.P5
N$21
  Top 0.2: R10.1 36,33.9 37.35,32.55 U4.P26
N$24
  Top 0.2: USB-C.A5 54.15,33.25 55,32.4 R13.1
N$31
  Top 0.2: C11.1 21.95,34.6 U4.P4
N$32
  Top 0.2: C15.1 40,33.8 38.75,32.55 U4.P28
N$33
  Top 0.2: C14.1 38.05,34.6 U4.P27
N$34
  Top 0.3: R16.1 15.35,33.1 15.15,32.9 L3.P$2
N$35
  Top 0.3: U6.5 12.85,33 L3.P$1
OLED_RST
  Top 0.2: R12.1 30.75,34.65 28.95,32.85 U4.P14 28.95,26.55 24.9,22.5 U5.29
SCL  (via drill 0.3 pad 0.6)
  Top 0.2: R18.1 20.9,15.95 v22,15.95 U5.31 | v32.9,21.6 v32.9,24.6 32.9,26.5 31.75,27.65 U4.P18 | J2.4 6.5,31 6.99,30.51 v6.99,28.99
  Bottom 0.2: v22,15.95 24.65,15.95 29.95,21.25 32.55,21.25 v32.9,21.6 | v6.99,28.99 6.99,26.61 9.35,24.25 31.05,24.25 31.4,24.6 v32.9,24.6
SDA  (via drill 0.3 pad 0.6)
  Top 0.2: R17.1 21.6,14.5 v21.95,14.85 22.2,15.1 U5.32 | v33.7,21.2 v33.7,25.3 33.7,26.7 33.15,27.25 U4.P20 U4.P19 | J2.3 6.5,32 7.6,30.9 v7.6,29.6
  Bottom 0.2: v21.95,14.85 24.05,14.85 30.1,20.9 33.4,20.9 v33.7,21.2 | v7.6,29.6 7.6,26.5 9.5,24.6 30.9,24.6 31.6,25.3 v33.7,25.3
USB_DN  (via drill 0.3 pad 0.6)
  Top 0.2: USB-C.B7 51.45,33.75 v51.1,33.4 51.1,34.3 51.55,34.75 USB-C.A7 | v30,18.2 U5.23
  Bottom 0.2: v51.1,33.4 51.1,29.8 51.38,29.52 51.38,24.38 47.1,20.1 32.7,20.1 30.8,18.2 v30,18.2
USB_DP  (via drill 0.3 pad 0.6)
  Top 0.2: USB-C.A6 53.65,34.25 53.9,34.5 53.9,35 53.65,35.25 USB-C.B6 51.19,35.25 v51.16,35.21 | v29.15,18.88 U5.24
  Bottom 0.2: v51.16,35.21 50.49,34.55 50.49,29.88 51.02,29.35 51.02,24.52 46.98,20.48 32.55,20.48 30.95,18.88 v29.15,18.88
VDD  (via drill 0.3 pad 0.6)
  Top 0.3: L2.P$2 15.35,2.5 13.5,2.5 D1.A 12,1 v10.5,1 | U7.8 10,3.3 v10,4 | R12.2 33.25,36.35 34.5,37.6 43.3,37.6 44.52,36.38 L1.P1 46.73,36.38 L1.P1.1
  Top 0.5: v13.5,9.5 14,10 U1.5 17.5,10 18,10.5 18,12.8 17.5,13.3 U1.8 14.2,13.3 13.74,13.76 C4.2 | C4.2 5.6,16 3.85,17.75 v3.85,18.5 | v3.85,18.5 C17.2 3.65,21.2 U8.P5 | R1.1 41.05,8.55 v41.5,8.1 | v49,14.8 U2.13 49,19.85 C3.2 | C4.2 13.74,17.14 14.7,18.1 20.6,18.1 23.35,20.85 U4.P6 | J2.2 4.4,33 3.6,32.2 3.6,29.2 0.9,26.5 0.9,19 1.4,18.5 v3.85,18.5
  Bottom 0.5: v13.5,9.5 11,9.5 10,8.5 v10,4 10,1.5 v10.5,1 39.4,1 41.5,3.1 v41.5,8.1 41.5,12.6 43.7,14.8 v49,14.8
  pour Top: 29.1,35.2 30.65,36.75 32.1,36.75 32.1,35.5 31.1,35.5 27.2,31.6 27.2,31.1 23.2,31.1 23.2,35.2
VPP  (via drill 0.3 pad 0.6)
  Top 0.5: U6.3 9.82,32.15 C8.2 7.55,32.15 7.2,32.5 7.2,35.9 7.9,36.6 v13.6,36.6 | R16.2 13.65,36.55 v13.6,36.6 | v13.6,36.6 15.3,38.3 43.7,38.3 44.6,37.4 49.9,37.4 50.33,36.98 | USB-C.B4A9 50.4,36.9 50.33,36.98 | USB-C.A4B9 51,32.1 50.33,32.77 50.33,36.98

### Text on the board
bNames: LORA-GPS v1 / @maker.moekoe / 12.04.2022